# EAGLE design PIDDYBOT_V1 (EAGLE 6.5.0)
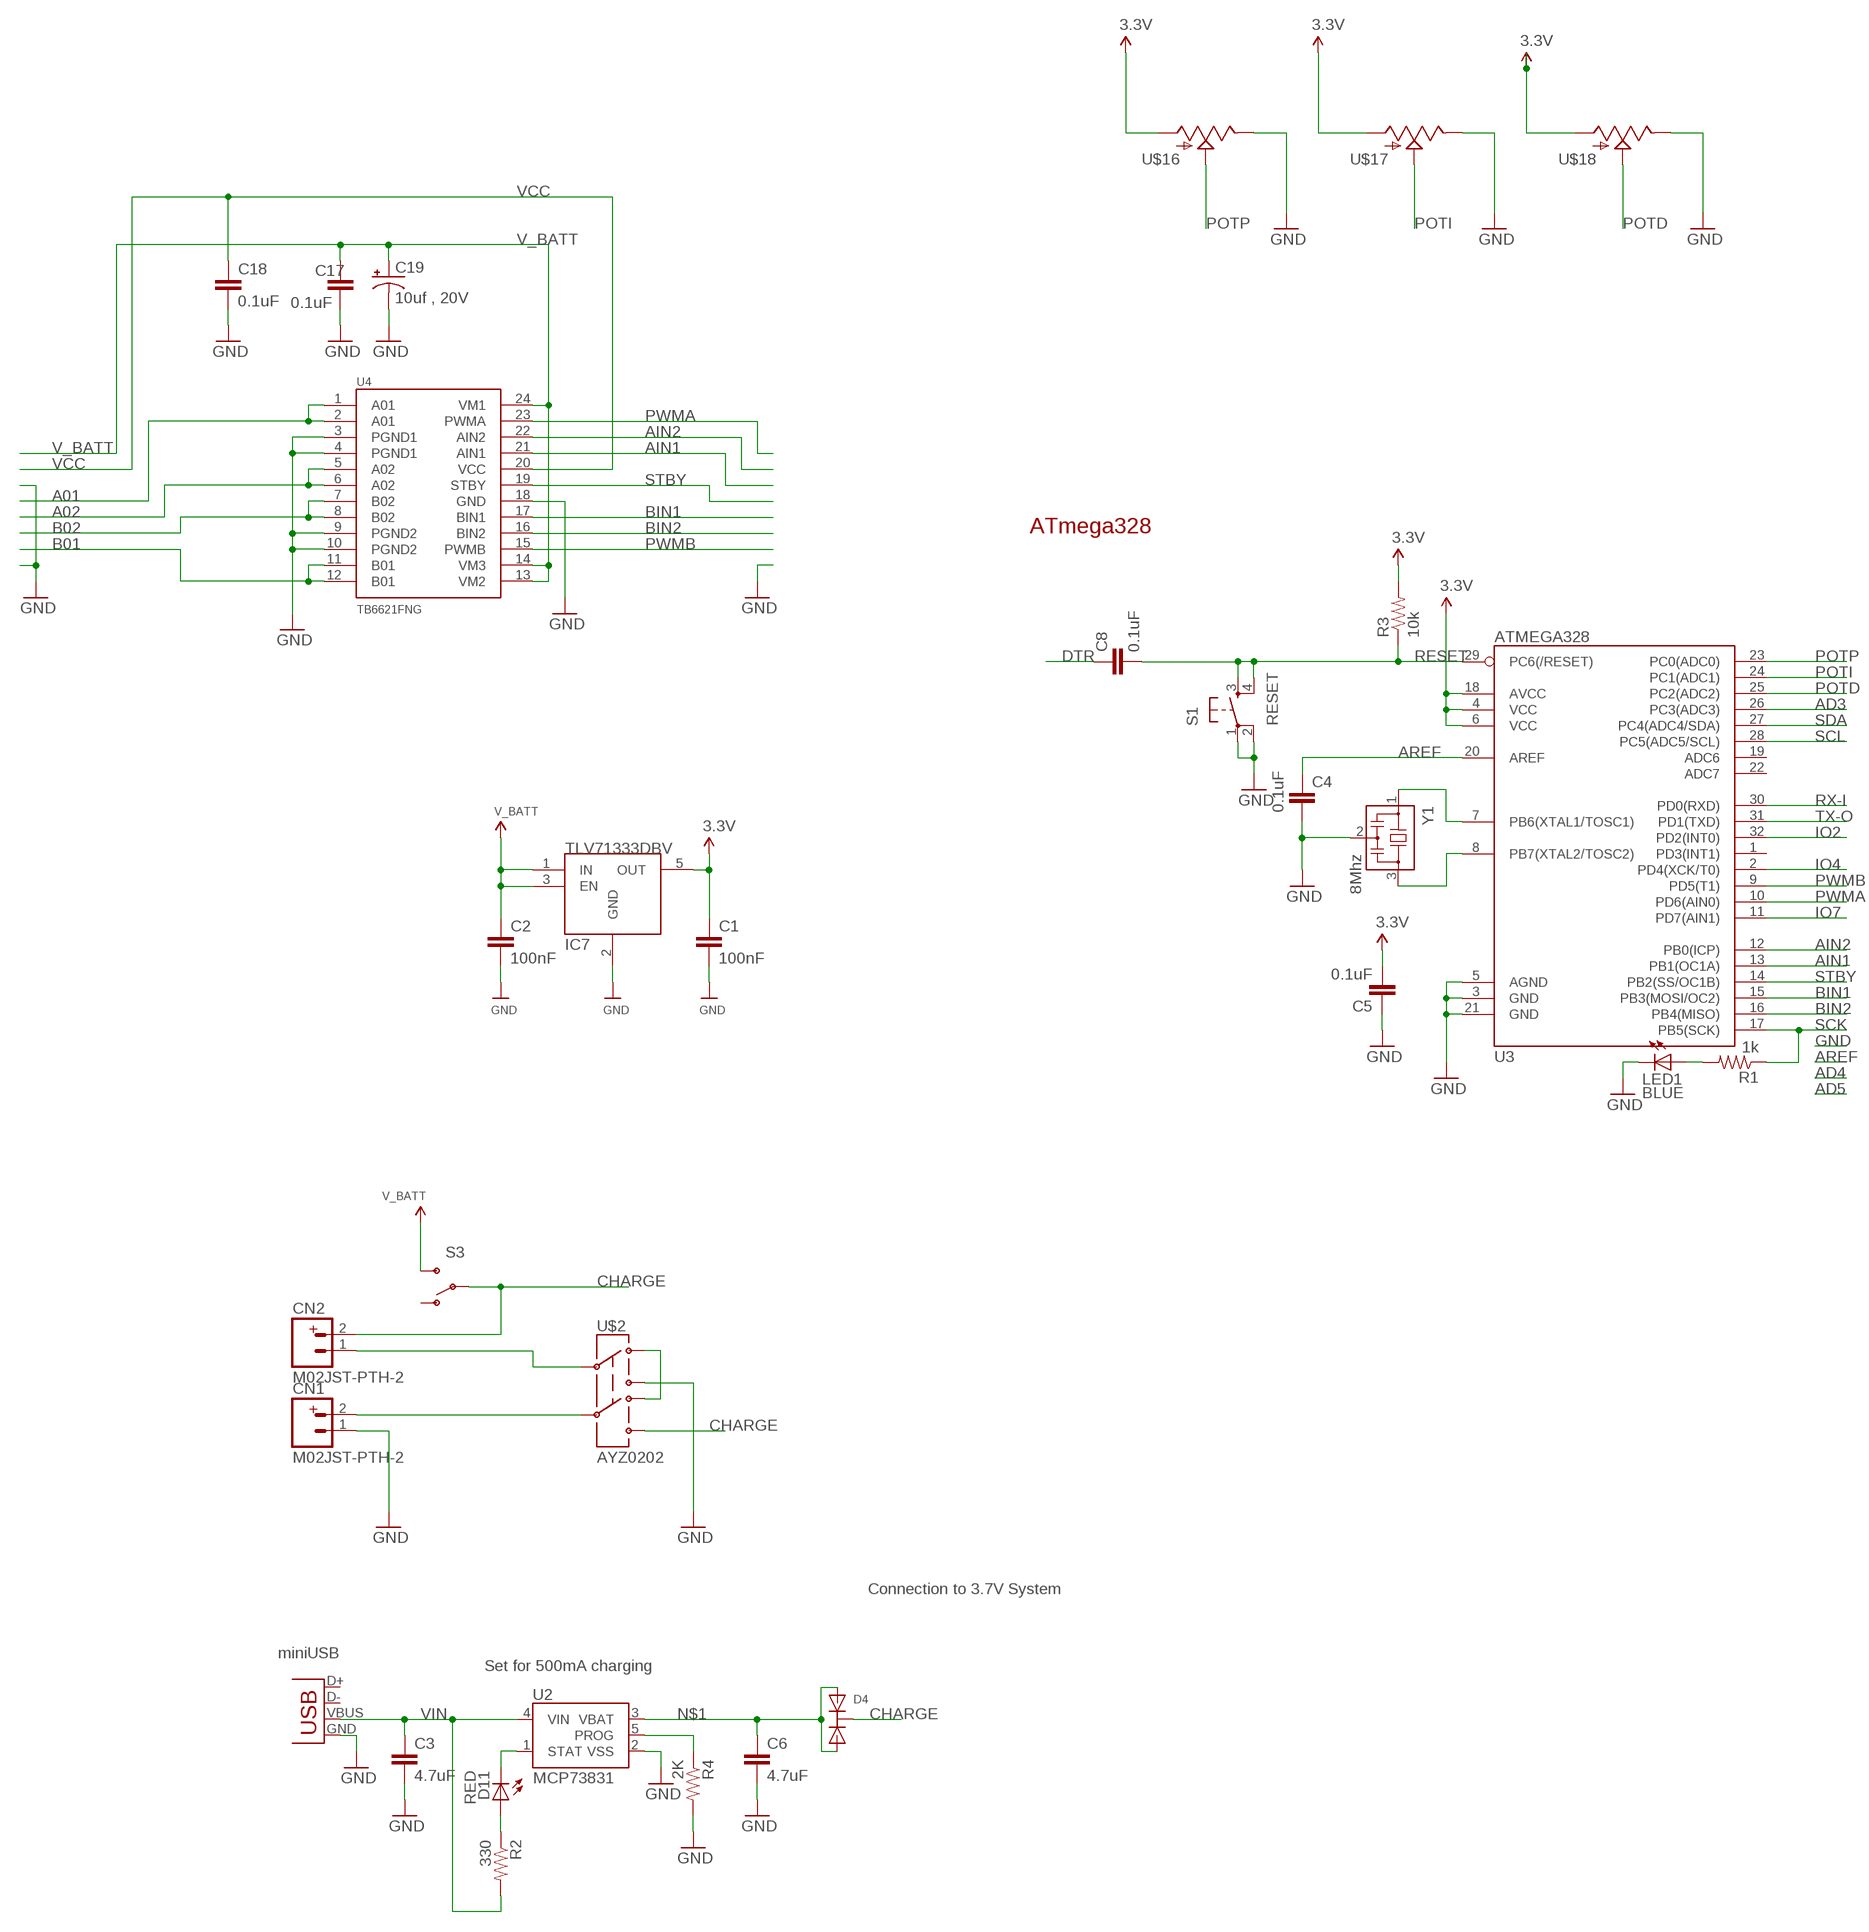
[diagram p0: schematic, sheet 1, part 1 of 2]
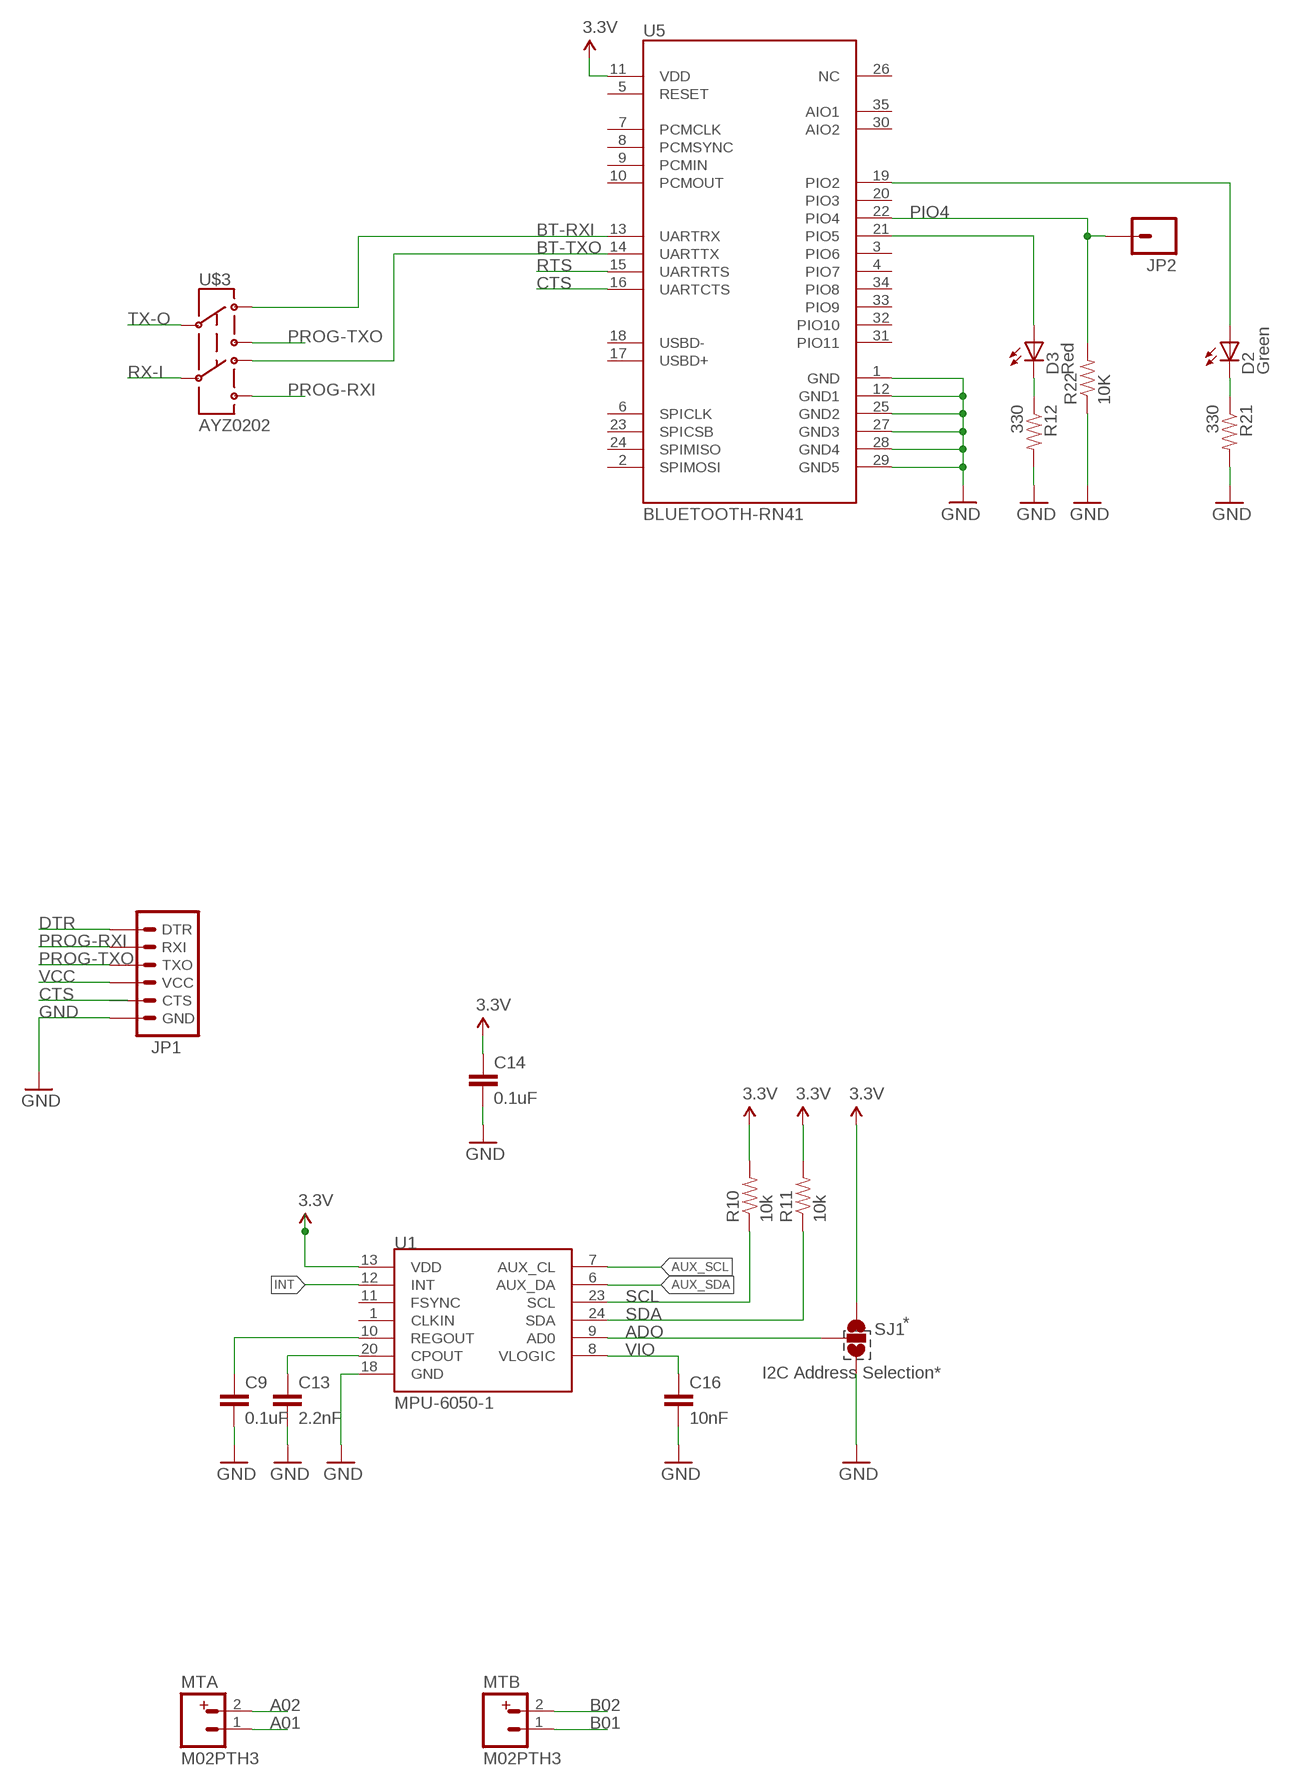
[diagram p1: schematic, sheet 1, part 2 of 2]

## Parts
C1  100nF  C-EUC0603K  [C0603K]
C2  100nF  C-EUC0603K  [C0603K]
C3  4.7uF  CAP0402-CAP  [0402-CAP]
C4  0.1uF  CAP0402-CAP  [0402-CAP]
C5  0.1uF  CAP0402-CAP  [0402-CAP]
C6  4.7uF  CAP0402-CAP  [0402-CAP]
C8  0.1uF  CAP0402-CAP  [0402-CAP]
C9  0.1uF  CAP0603-CAP  [0603-CAP]
C13  2.2nF  CAP0603-CAP  [0603-CAP]
C14  0.1uF  CAP0603-CAP  [0603-CAP]
C16  10nF  CAP0603-CAP  [0603-CAP]
C17  0.1uF  CAP0402-CAP  [0402-CAP]
C18  0.1uF  CAP0402-CAP  [0402-CAP]
C19  10uf , 20V  CAP_POL3528  [EIA3528]
CN1  M02JST-PTH-2  [JST-2-PTH]
CN2  M02JST-PTH-2  [JST-2-PTH]
D2  Green  LED0603  [LED-0603]
D3  Red  LED0603  [LED-0603]
D4  BAT54C  [SOT23-R]
D11  RED  LED0603  [LED-0603]
IC7  TLV71333DBV  [SOT-23-5]
JP1  ARDUINO_SERIAL_PROGRAMSMD  [1X06-SMD]
JP2  M01SMDNS  [1X01NS]
LED1  BLUE  LED0603  [LED-0603]
MTA  M02PTH3  [1X02_LONGPADS]
MTB  M02PTH3  [1X02_LONGPADS]
R1  1k  RESISTOR0402-RES  [0402-RES]
R2  330  RESISTOR0402-RES  [0402-RES]
R3  10k  RESISTOR0402-RES  [0402-RES]
R4  2K  RESISTOR0402-RES  [0402-RES]
R10  10k  RESISTOR0603-RES  [0603-RES]
R11  10k  RESISTOR0603-RES  [0603-RES]
R12  330  RESISTOR0402-RES  [0402-RES]
R21  330  RESISTOR0402-RES  [0402-RES]
R22  10K  RESISTOR0402-RES  [0402-RES]
S1  RESET  TAC_SWITCHSMD  [TACTILE_SWITCH_SMD]
S3  SWITCH-SPDTPTH  [SWITCH-SPDT]
SJ1  SOLDERJUMPER_2WAYPASTE2&3  [SJ_3_PASTE2&3]
U1  MPU-6050-1  [QFN-24-4MM2]
U2  MCP73831  [SOT23-5]
U3  ATMEGA328  ATMEGA168  [TQFP32-08]
U4  TB6621FNG  [SSOP24]
U5  BLUETOOTH-RN41  BLUETOOTH-RN41"  [RN41]
U$2  AYZ0202  [AYZ0202]
U$3  AYZ0202  [AYZ0202]
U$16  POT  [ALPS_POT]
U$17  POT  [ALPS_POT]
U$18  POT  [ALPS_POT]
X1  Micro USB  USBSMD  [USB-MINIB]
Y1  8Mhz  CSTCR6M00G53Z  [CSTCR6M]

## Nets
A01: MTA.1 U4.1(A01) U4.2(A01)
A02: MTA.2 U4.5(A02) U4.6(A02)
AD3: U3.26(PC3(ADC3))
ADO: SJ1.2 U1.9(AD0)
AIN1: U3.13(PB1(OC1A)) U4.21(AIN1)
AIN2: U3.12(PB0(ICP)) U4.22(AIN2)
AREF: C4.1 U3.20(AREF)
AUX_SCL: U1.7(AUX_CL)
AUX_SDA: U1.6(AUX_DA)
B01: MTB.1 U4.11(B01) U4.12(B01)
B02: MTB.2 U4.7(B02) U4.8(B02)
BIN1: U3.15(PB3(MOSI/OC2)) U4.17(BIN1)
BIN2: U3.16(PB4(MISO)) U4.16(BIN2)
BT-RXI: U5.13(UARTRX) U$3.3
BT-TXO: U5.14(UARTTX) U$3.6
CHARGE: CN2.2 D4.3(C) S3.2(P) U$2.4
CTS: U5.16(UARTCTS)
D1: D3.C R12.1
D2: D2.C R21.1
DTR: C8.1 JP1.1(DTR)
GND [vcc]: C1.2 C2.2 C3.2 C4.2 C5.1 C6.2 C9.2 C13.2 C14.2 C16.2 C17.2 C18.2 C19.C(-) CN1.1 IC7.2(GND) JP1.6(GND) LED1.C R4.2 R12.2 R21.2 R22.1 S1.1 S1.2 SJ1.3 U1.18(GND) U2.2(VSS) U3.3(GND) U3.5(AGND) U3.21(GND) U4.3(PGND1) U4.4(PGND1) U4.9(PGND2) U4.10(PGND2) U4.18(GND) U5.1(GND) U5.12(GND1) U5.25(GND2) U5.27(GND3) U5.28(GND4) U5.29(GND5) U$2.1 U$16.P$1(E) U$17.P$1(E) U$18.P$1(E) X1.GND Y1.2
INT: U1.12(INT)
IO2: U3.32(PD2(INT0))
IO4: U3.2(PD4(XCK/T0))
IO7: U3.11(PD7(AIN1))
N$1: C6.1 D4.1(A1) D4.2(A2) U2.3(VBAT)
N$2: CN2.1 U$2.2
N$3: LED1.A R1.2
N$4: U3.7(PB6(XTAL1/TOSC1)) Y1.1
N$5: U3.8(PB7(XTAL2/TOSC2)) Y1.3
N$6: C13.1 U1.20(CPOUT)
N$7: C9.1 U1.10(REGOUT)
N$8: CN1.2 U$2.5
N$9: D3.A U5.21(PIO5)
N$10: U$2.3 U$2.6
N$11: D2.A U5.19(PIO2)
N$13: D11.A R2.1
PIO4: JP2.1 R22.2 U5.22(PIO4)
POTD: U3.25(PC2(ADC2)) U$18.P$2(S)
POTI: U3.24(PC1(ADC1)) U$17.P$2(S)
POTP: U3.23(PC0(ADC0)) U$16.P$2(S)
PROG: R4.1 U2.5(PROG)
PROG-RXI: JP1.2(RXI) U$3.4
PROG-TXO: JP1.3(TXO) U$3.1
PWMA: U3.10(PD6(AIN0)) U4.23(PWMA)
PWMB: U3.9(PD5(T1)) U4.15(PWMB)
RESET: C8.2 R3.1 S1.3 S1.4 U3.29(PC6(/RESET))
RTS: U5.15(UARTRTS)
RX-I: U3.30(PD0(RXD)) U$3.5
SCK: R1.1 U3.17(PB5(SCK))
SCL: R10.1 U1.23(SCL) U3.28(PC5(ADC5/SCL))
SDA: R11.1 U1.24(SDA) U3.27(PC4(ADC4/SDA))
STAT: D11.C U2.1(STAT)
STBY: U3.14(PB2(SS/OC1B)) U4.19(STBY)
TX-O: U3.31(PD1(TXD)) U$3.2
V_BATT: C2.1 C17.1 C19.A(+) IC7.1(IN) IC7.3(EN) S3.3(S) U4.13(VM2) U4.14(VM3) U4.24(VM1)
VCC: C1.1 C5.2 C14.1 C18.1 IC7.5(OUT) JP1.4(VCC) R3.2 R10.2 R11.2 SJ1.1 U1.13(VDD) U3.4(VCC) U3.6(VCC) U3.18(AVCC) U4.20(VCC) U5.11(VDD) U$16.P$3(A) U$17.P$3(A) U$18.P$3(A) ; supply symbol labelled 3.3V
VIN: C3.1 R2.2 U2.4(VIN) X1.VBUS
VIO: C16.1 U1.8(VLOGIC)
Unconnected: JP1.5(CTS) S3.1(O) U1.1(CLKIN) U1.11(FSYNC) U3.1(PD3(INT1)) U3.19(ADC6) U3.22(ADC7) U5.2(SPIMOSI) U5.3(PIO6) U5.4(PIO7) U5.5(RESET) U5.6(SPICLK) U5.7(PCMCLK) U5.8(PCMSYNC) U5.9(PCMIN) U5.10(PCMOUT) U5.17(USBD+) U5.18(USBD-) U5.20(PIO3) U5.23(SPICSB) U5.24(SPIMISO) U5.26(NC) U5.30(AIO2) U5.31(PIO11) U5.32(PIO10) U5.33(PIO9) U5.34(PIO8) U5.35(AIO1) X1.D+ X1.D-

## Notes on the sheet
- ATmega328
- *
- I2C Address Selection*
- Connection to 3.7V System
- miniUSB
- Set for 500mA charging

## Library data of the parts
C1 C2 = rcl:C-EU: CAPACITOR, European symbol
C3-C6 C8 C9 C13 C14 C16-C18 = SparkFun:CAP: Capacitor Standard 0603 ceramic capacitor, and 0.1" leaded capacitor.
C19 = SparkFun:CAP_POL: Capacitor Polarized These are standard SMD and PTH capacitors. Normally 10uF, 47uF, and 100uF in electrolytic and tantalum varieties. Always verify the external diameter of the through hole cap, it varies with capacity, voltage, and manufacturer. The EIA devices should be standard.
CN1 CN2 MTA MTB = SparkFun-Connectors:M02: Standard 2-pin 0.1" header. Use with - straight break away headers ( PRT-00116) - right angle break away headers (PRT-00553) - swiss pins (PRT-00743) - machine pins (PRT-00117) - female headers (PRT-00115) Molex polarized connector foot print use with: PRT-08233 with associated crimp pins and housings. 2.54_SCREWTERM for use with PRT-10571. 3.5mm Screw Terminal footprints for PRT-08084 5mm Screw Terminal footprints for use with PRT-08433
D2 D3 D11 LED1 = SparkFun:LED: LEDs Standard schematic elements and footprints for 5mm, 3mm, 1206, and 0603 sized LEDs. 5mm - Spark Fun Electronics SKU : COM-00529 (and others)
D4 = microbuilder:BAT54C: BAT54C Schottky Diodes (Common Cathode) Vf: 800mV, 30V 200mA Digikey: BAT54CFSCT-ND For 300mA see BAT54CFILM: Vf: 900mV, 40V 300mA Digkey: 497-3786-2-ND
IC7 = anoven:TLV713: Capacitor-Free, 150-mA, Low-Dropout Regulator with Foldback Current Limit for Portable Devices
JP1 = SparkFun-Connectors:ARDUINO_SERIAL_PROGRAM: FTDI connector footprints
JP2 = SparkFun:M01: Header 1 Standard 1-pin 0.1" header. Use with straight break away headers (SKU : PRT-00116), right angle break away headers (PRT-00553), swiss pins (PRT-00743), machine pins (PRT-00117), and female headers (PRT-00115).
R1-R4 R10-R12 R21 R22 = SparkFun:RESISTOR: Resistor Basic schematic elements and footprints for 0603, 1206, and PTH resistors.
S1 = SparkFun:TAC_SWITCH: Momentary Switch Button commonly used for reset or general input. Spark Fun Electronics SKU : COM-00097
S3 = SparkFun-Electromechanical:SWITCH-SPDT: SPDT Switch Simple slide switch, Spark Fun Electronics SKU : COM-00102 DPDT SMT slide switch, AYZ0202, SWCH-08179
SJ1 = SparkFun:SOLDERJUMPER_2WAY: Solder Jumper 2 way solder jumper
U1 = Testing:MPU-6050
U2 = SparkFun:MCP73831: Microchip's MCP73831 Miniature single cell, fully integrated Li-Ion, Li-polymer charge management controller http://ww1.microchip.com/downloads/en/DeviceDoc/21984a.pdf
U3 = SparkFun:ATMEGA168
U4 = SparkFun:TB6621FNG: Toshiba 1A motor driver
U5 = ScratchPad:BLUETOOTH-RN41
U$2 U$3 = SparkFun-Electromechanical:AYZ0202: SPDT Slide Switch Simple SMD single-pull double-throw slide switch. Good for less than 350mA power switch, switching UARTs between devices, etc. Spark Fun Electronics SKU : COM-00597
U$16-U$18 = SparkFun-Electromechanical:POT
X1 = SparkFun:USB: USB Connectors USB-B-PTH is fully proven SKU : PRT-00139 USB-miniB is fully proven SKU : PRT-00587 USB-A-PCB is untested. USB-A-H is throughly reviewed, but untested. Spark Fun Electronics SKU : PRT-00437 USB-B-SMT is throughly reviewed, but untested. Needs silkscreen touching up. USB-A-S has not been used/tested USB-MB-H has not been used/tested
Y1 = murata-filter:CSTCR: Resonator Source: murata.co.jp; MPN: CSTCR6M00G53-R0; OC_FARNELL: 1170434; OC_NEWARK: 25M8759

## Net classes
1 vcc: width 0.254 mm

## Board
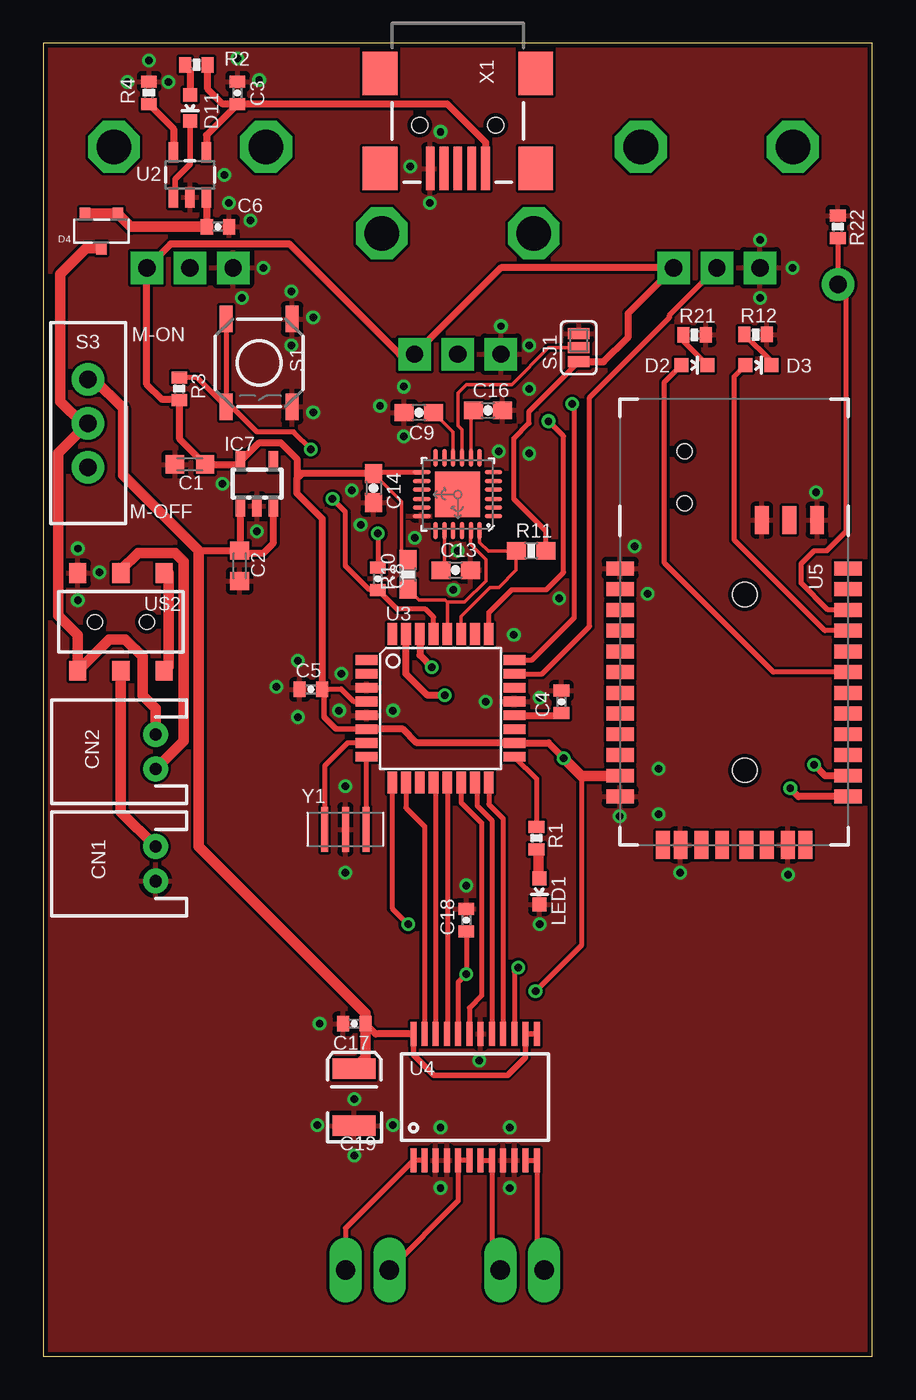
[diagram p2: board, top side]
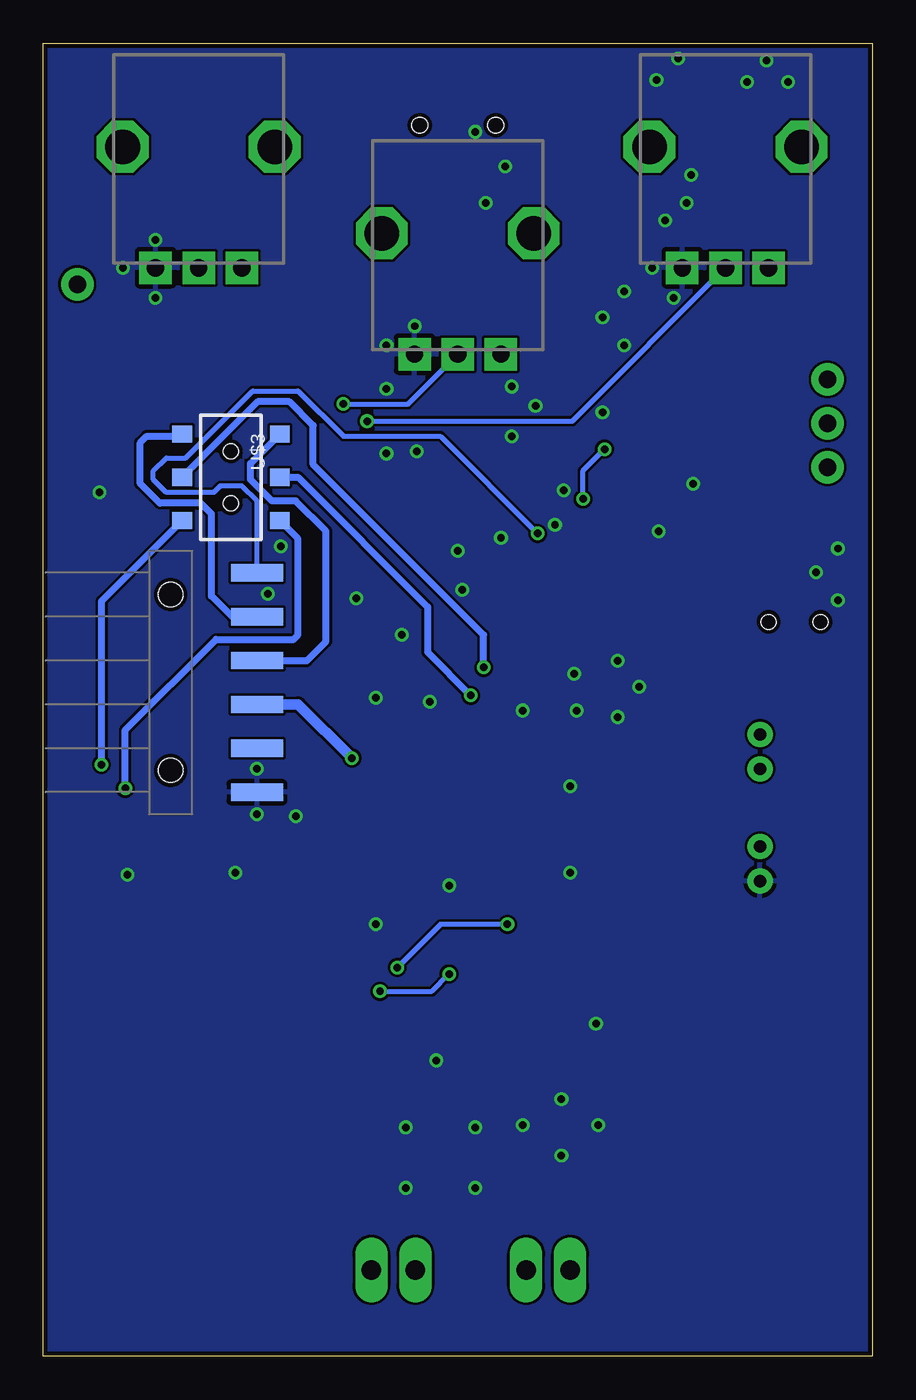
[diagram p3: board, bottom side, seen from below]

Size 48 x 76 mm. Coordinates in mm from the lower left corner, seen from the top.
Outline: 0,0 48,0 48,76 0,76 0,0
Copper layers (1*16): Top 0.0356mm / dielectric 1.5011mm / Bottom 0.0356mm
Design rules "LaenPCBOrder *": minimum track width 6mil, minimum drill 13mil, track to track 6mil, track to pad 6mil, pad to pad 6mil, via to via 6mil, smd to smd 6mil, copper to edge 10mil, drill to drill 6mil, minimum pad ring 7mil, minimum via ring 7mil, stop-mask expansion 3mil, vias tented up to drill 0mil, thermal gap 10mil

### Footprints (pad centres in the part's own frame; a part is rotated, then mirrored left to right if it is on the bottom)
C0603K = smd 1.05 x 1.08: 1 -0.875,0; 2 0.875,0
0402-CAP = smd 0.7 x 0.9: 1 -0.65,0; 2 0.65,0
0603-CAP = smd 1.1 x 1: 1 -0.85,0; 2 0.85,0
EIA3528 = smd 1.2 x 2.5: A 1.65,0; C -1.65,0
JST-2-PTH = drill 0.7 pad 1.448: 1 -1,0; 2 1,0
LED-0603 = smd 0.8 x 0.8: A 0,-0.75; C 0,0.75
SOT23-R = smd 0.6 x 0.7: 1 -0.95,-1; 2 0.95,-1; 3 0,1
SOT-23-5 = smd 0.55 x 1.2: 1 -0.95,-1.3; 2 0,-1.3; 3 0.95,-1.3; 4 0.95,1.3; 5 -0.95,1.3
1X06-SMD = smd 1 x 3: 1 -6.35,5; 2 -3.81,5; 3 -1.27,5; 4 1.27,5; 5 3.81,5; 6 6.35,5 | hole 1.4: -5.08,0; 5.08,0
1X01NS = drill 1.016 pad 1.88: 1 0,0
1X02_LONGPADS = drill 1.118 pad 1.88 long: 1 0,0; 2 2.54,0
0402-RES = smd 0.7 x 0.9: 1 -0.65,0; 2 0.65,0
0603-RES = smd 1.1 x 1: 1 -0.85,0; 2 0.85,0
TACTILE_SWITCH_SMD = smd 1.524 x 0.762: 1 -2.54,1.905; 2 2.54,1.905; 3 -2.54,-1.905; 4 2.54,-1.905
SWITCH-SPDT = drill 1.016 pad 1.88: 1 0,2.54; 2 0,0; 3 0,-2.54
SJ_3_PASTE2&3 = smd 0.635 x 1.27: 1 -0.813,0; 2 0,0; 3 0.813,0
QFN-24-4MM2 = smd 1.016 x 0.254: 1 -2.066,1.257; 2 -2.066,0.75; 3 -2.066,0.247; 4 -2.066,-0.287; 5 -2.066,-0.792; 6 -2.066,-1.297; 13 2.086,-1.297; 14 2.086,-0.792; 15 2.086,-0.287; 16 2.086,0.247; 17 2.086,0.75; 18 2.086,1.257 | smd 0.254 x 1.016: 7 -1.267,-2.122; 8 -0.762,-2.122; 9 -0.258,-2.122; 10 0.278,-2.122; 11 0.78,-2.122; 12 1.287,-2.122; 19 1.287,2.082; 20 0.78,2.082; 21 0.278,2.082; 22 -0.258,2.082; 23 -0.762,2.082; 24 -1.267,2.082 | smd 2.616 x 2.616: P$1 0.02,-0.01
SOT23-5 = smd 0.55 x 1.2: 1 -0.95,-1.3; 2 0,-1.3; 3 0.95,-1.3; 4 0.95,1.3; 5 -0.95,1.3
TQFP32-08 = smd 1.27 x 0.559: 1 -4.293,2.8; 2 -4.293,2; 3 -4.293,1.2; 4 -4.293,0.4; 5 -4.293,-0.4; 6 -4.293,-1.2; 7 -4.293,-2; 8 -4.293,-2.8; 17 4.293,-2.8; 18 4.293,-2; 19 4.293,-1.2; 20 4.293,-0.4; 21 4.293,0.4; 22 4.293,1.2; 23 4.293,2; 24 4.293,2.8 | smd 0.559 x 1.27: 9 -2.8,-4.293; 10 -2,-4.293; 11 -1.2,-4.293; 12 -0.4,-4.293; 13 0.4,-4.293; 14 1.2,-4.293; 15 2,-4.293; 16 2.8,-4.293; 25 2.8,4.293; 26 2,4.293; 27 1.2,4.293; 28 0.4,4.293; 29 -0.4,4.293; 30 -1.2,4.293; 31 -2,4.293; 32 -2.8,4.293
SSOP24 = smd 0.348 x 1.397: 1 -3.575,-3.656; 2 -2.925,-3.656; 3 -2.275,-3.656; 4 -1.625,-3.656; 5 -0.975,-3.656; 6 -0.325,-3.656; 7 0.325,-3.656; 8 0.975,-3.656; 9 1.625,-3.656; 10 2.275,-3.656; 11 2.925,-3.656; 12 3.575,-3.656; 13 3.575,3.656; 14 2.925,3.656; 15 2.275,3.656; 16 1.625,3.656; 17 0.975,3.656; 18 0.325,3.656; 19 -0.325,3.656; 20 -0.975,3.656; 21 -1.625,3.656; 22 -2.275,3.656; 23 -2.925,3.656; 24 -3.575,3.656
RN41 = smd 0.8 x 1.6: 1 -6.6,-6.6; 2 -5.4,-6.6; 3 -4.2,-6.6; 4 -3,-6.6; 5 -1.8,-6.6; 6 -0.6,-6.6; 7 0.6,-6.6; 8 1.8,-6.6; 9 3,-6.6; 10 4.2,-6.6; 11 5.4,-6.6; 12 6.6,-6.6; 13 6.6,6.6; 14 5.4,6.6; 15 4.2,6.6; 16 3,6.6; 17 1.8,6.6; 18 0.6,6.6; 19 -0.6,6.6; 20 -1.8,6.6; 21 -3,6.6; 22 -4.2,6.6; 23 -5.4,6.6; 24 -6.6,6.6 | smd 1.6 x 0.8: 25 -9.4,4.8; 26 -9.4,3.2; 27 -9.4,1.6; 28 9.4,3.1; 29 9.4,-3.1; 30 9.4,-4.122; 31 9.4,-1.9; 32 9.4,-0.7; 33 9.4,0.7; 34 9.4,1.9; 35 9.4,4.122
AYZ0202 = smd 1 x 1.15: 1 -2.5,2.825; 2 0,2.825; 3 2.5,2.825; 4 -2.5,-2.825; 5 0,-2.825; 6 2.5,-2.825 | hole 0.85: 1.5,0; -1.5,0
ALPS_POT = drill 1 pad 1.88 square: P$1 7,-2.5; P$2 7,0; P$3 7,2.5 | drill 2 octagon: P$4 0,-4.4; P$5 0,4.4
USB-MINIB = smd 2.5 x 0.5: D+ 2.5,0; D- 2.5,0.8; GND 2.5,-1.6; ID 2.5,-0.8; VBUS 2.5,1.6 | smd 2.5 x 2: MTN1 -3,4.5; MTN2 2.5,4.5; MTN3 -3,-4.5; MTN4 2.5,-4.5 | hole 0.9: 0,2.2; 0,-2.2
CSTCR6M = smd 0.4 x 2.6: 1 -1.2,0; 2 0,0; 3 1.2,0

### Placement (x,y rotation side)
C1  8.5,51.62 180 top
C2  11.38,45.75 270 top
C3  11.25,73.12 90 top
C4  30,37.88 90 top
C5  15.5,38.59 0 top
C6  10.12,65.38 0 top
C8  19.38,45 270 top
C9  21.75,54.62 180 top
C13  23.88,45.5 0 top
C14  19.12,50.25 270 top
C16  25.75,54.75 0 top
C17  18,19.25 180 top
C18  24.5,25.25 90 top
C19  18,15 90 top
CN1  6.5,28.5 90 top
CN2  6.5,35 90 top
D2  37.7,57.37 270 top
D3  41.4,57.36 270 top
D4  3.38,65.12 180 top
D11  8.5,72.25 180 top
IC7  12.38,50.5 0 top
JP1  40.62,39 270 bottom
JP2  46.02,62.05 0 top
LED1  28.73,26.91 180 top
MTA  17.5,5 0 top
MTB  29,5 180 top
R1  28.55,29.99 270 top
R2  8.88,74.75 0 top
R3  7.88,56 270 top
R4  6.12,73.12 90 top
R10  21.12,45.25 90 top
R11  28.25,46.62 0 top
R12  41.25,59.13 0 top
R21  37.71,59.12 0 top
R22  46,65.38 270 top
S1  12.5,57.5 270 top
S3  2.6,54 180 top
SJ1  31,58.38 90 top
U1  24,49.88 180 top
U2  8.5,68.38 0 top
U3  23,37.5 0 top
U4  25,15 0 top
U5  40,39 270 top
U$2  4.5,42.5 0 top
U$3  37.12,50.88 270 bottom
U$16  39,70 270 bottom
U$17  24,65 270 bottom
U$18  8.5,70 270 bottom
X1  24,71.25 270 top
Y1  17.5,30.5 0 top

### Tracks (layer width: path | path; a pad name or v marks a point on that pad's centre or on a via)
A01
  Top 0.3: U4.2 U4.1 17.5,7.42 MTA.1
A02
  Top 0.3: U4.6 U4.5 24.02,8.98 MTA.2
ADO
  Top 0.2: U1.9 24.26,53.37 24.25,53.38 24.25,53.62 24,53.88 24,55.75 24.5,56.25 27.12,56.25 29.25,58.38 SJ1.2
AIN1
  Top 0.3: U3.13 23.4,18.68 U4.21
AIN2
  Top 0.3: U3.12 22.73,33.08 U4.22
AREF
  Top 0.406: U3.20 29.88,37.1 C4.1
B01
  Top 0.3: U4.11 U4.12 28.57,5.42 MTB.1
B02
  Top 0.3: U4.7 U4.8 25.98,5.49 MTB.2
BIN1
  Top 0.3: U3.15 25.12,33.08 25.12,31.88 25.98,31.02 U4.17
BIN2
  Top 0.3: U3.16 25.8,31.95 26.62,31.12 U4.16
BT-RXI  (via drill 0.43)
  Top 0.406: U5.13 43.73,32.4 v43.25,32.88
  Bottom 0.406: v43.25,32.88 43.25,36.25 38,41.5 33.5,41.5 33.25,41.75 33.25,47.33 U$3.3
BT-TXO  (via drill 0.43)
  Top 0.406: U5.14 45.27,33.6 v44.62,34.25
  Bottom 0.406: v44.62,34.25 44.62,43.7 U$3.6
CHARGE
  Top 0.61: CN2.2 6.5,37.5 5.75,38.25 5.75,40.5 4.75,41.5 3.83,41.5 U$2.4 2,41.75 0.88,42.88 0.88,52.27 S3.2 2.25,54 1,55.25 1,62.62 2.5,64.12 D4.3
D1
  Top 0.3: D3.C 42.15,57.59 R12.1
D2
  Top 0.3: D2.C 37.06,58.76 R21.1
DTR  (via drill 0.43)
  Top 0.3: v19.38,47.62 C8.1
  Bottom 0.3: JP1.1 35.62,49.5 36.5,50.38 37.75,50.38 38.12,50 40.88,50 41.62,50.75 41.62,51.25 40.88,52 39.75,52 35.88,55.88 33.25,55.88 30.62,53.25 25,53.25 v19.38,47.62
GND  (via drill 0.43)
  other vias: 2,46.75 2,43.75 14.75,37 14.75,40.25 13.5,38.75 17.5,28 17.5,33 24.5,27.25 27,9.75 23,9.75 23,13.25 27,13.25 25.25,17.12 24,46.62 21.5,47.38 18.38,48.12 17.88,50.12 20.88,53.25 19.5,55 20.88,56.12 26.38,52.38 28.12,56 28.12,52.25 44.75,50 33.38,31.25 35.62,31.38 35.62,34 36.88,28 43.12,27.88 28.75,25 15.88,13.38 18,14.88 18,11.62 20.25,13.38 16,19.25 11.5,61.25 12.75,63 26.5,59.62 28.12,58.5 41.5,64.62 43.38,63 41.5,61.25 22.38,66.75 21.25,68.88 12,65.75 10.75,66.75 6.12,75 4.88,73.75 7.25,73.75 12.5,73.88 11.25,75.12 10.5,68.38 10.38,50.5 12.38,47.75 3.25,45.38 15.62,60.12 14.38,61.62 14.38,58.5 15.62,54.62 34.25,46.88 35,44.12 17.25,39.5 20.25,37.38 17.12,37.38 25.62,37.88 28.75,38.12 23,70.88 23.75,44.38 29.88,43.88 27.25,41.75
  pour Top: 0,0 48,0 48,76 0,76
  pour Bottom: 0,0 48,0 48,76 0,76
N$1
  Top 0.406: U2.3 9.47,67.05 C6.1
  Top 0.61: C6.1 5.08,65.38 D4.1 D4.2
N$2
  Top 0.61: U$2.2 4.5,45.5 5.5,46.5 7.62,46.5 8.12,46 8.12,35.62 CN2.1
N$3
  Top 0.3: R1.2 28.67,29.23
  Top 0.61: 28.67,29.23 28.67,27.71 LED1.A
N$4
  Top 0.3: U3.7 17.62,35.5 16.3,34.17 Y1.1
N$5
  Top 0.3: U3.8 Y1.3
N$6
  Top 0.2: U1.20 23.22,45.7 C13.1
N$7
  Top 0.2: C9.1 23.72,53.5 U1.10
N$8
  Top 0.61: CN1.2 4.5,31.5 U$2.5
N$9
  Top 0.3: U5.21 45.25,42 40,47.25 40,56.71 D3.A
N$10
  Top 0.61: U$2.3 7.25,45.33 7.25,39.92 U$2.6
N$11
  Top 0.3: U5.19 42.27,39.6 35.95,45.92 35.95,56.37 D2.A
N$13
  Top 0.406: R2.1 8.5,74.47 D11.A
PIO4
  Top 0.3: U5.22 45.42,43.2 43.88,44.75 43.88,45.88 44.62,46.62 45.38,46.62 46.5,47.75 46.5,61.58 JP2.1 46.02,64.7 R22.2
POTD  (via drill 0.43)
  Top 0.3: U3.25 25.8,43.05 27.12,44.38 29.12,44.38 30.12,45.38 30.12,53.25 v29.25,54.12
  Bottom 0.3: v29.25,54.12 17.38,54.12 U$18.P$2
POTI  (via drill 0.43)
  Top 0.3: U3.24 28.3,40.3 30.75,42.75 30.75,55 v30.62,55.12 30.62,55
  Bottom 0.3: v30.62,55.12 26.88,55.12 U$17.P$2
POTP
  Top 0.3: U3.23 28.88,39.5 31.62,42.25 31.62,55.5 36.25,60.12 36.25,60.25 U$16.P$2
PROG
  Top 0.406: R4.1 7.55,71.05 U2.5
PROG-RXI
  Bottom 0.406: JP1.2 37.06,42.81 38.25,44 38.25,48.75 38.88,49.38 41.25,49.38 42.38,50.5 42.38,52.88 42,53.25 40.08,53.25 U$3.4
PROG-TXO
  Bottom 0.406: JP1.3 34.48,40.27 34.46,40.25 32.75,40.25 31.62,41.38 31.62,47.75 33.38,49.5 34.75,49.5 36,50.75 36,51.67 U$3.1
PWMA
  Top 0.3: U3.10 21,31.75 22.07,30.68 U4.23
PWMB  (via drill 0.43)
  Top 0.3: U3.9 20.2,25.93 v21.12,25 | v27.5,22.5 27.27,22.27 U4.15
  Bottom 0.3: v21.12,25 25,25 v27.5,22.5
RESET  (via drill 0.43)
  Top 0.3: U3.29 22.6,42.77 22.12,43.25 20.48,43.25 C8.2 18.9,44.35 17.5,45.75 17.5,48.88 v16.75,49.62 | S1.4 10.91,54.96 12.38,53.5 14.5,53.5 v15.5,52.5 | S1.4 8.9,56.65 R3.1 | S1.3 S1.4
  Bottom 0.3: v16.75,49.62 16.75,51.25 v15.5,52.5
RX-I  (via drill 0.43)
  Top 0.406: U3.30 21.8,40.58 v22.5,39.88
  Bottom 0.406: v22.5,39.88 22.5,41.75 32.38,51.62 32.38,53.88 33.75,55.25 35.58,55.25 U$3.5
SCK
  Top 0.3: U3.17 28.55,33.44 R1.1
SCL
  Top 0.2: 23.4,43.65 U3.28 | 23.4,43.65 24.4,43.65 25.62,44.88 25.62,46.12 24.75,47 U1.23 | R10.1 21.75,43.77 23.27,43.77 23.4,43.65
SDA
  Top 0.2: U3.27 24.2,42.83 25.88,44.5 26.38,44.5 27.38,45.5 27.38,46.6 | U1.24 25.27,47.11 25.77,46.6 27.38,46.6 | 27.38,46.6 R11.1
STAT
  Top 0.305: U2.1 7.62,67.08 7.62,68.12 8.5,69 D11.C
STBY
  Top 0.3: U3.14 24.2,32.05 25.38,30.88 25.38,20.88 24.68,20.18 U4.19
TX-O  (via drill 0.43)
  Top 0.406: v23.25,38.25 22.25,38.25 21,39.5 U3.31
  Bottom 0.406: U$3.2 33.25,50.88 25.75,43.38 25.75,40.75 v23.25,38.25
V_BATT
  Top 0.305: U4.24 21.43,17.45 22.62,16.25 26.88,16.25 27.93,17.3 U4.14 U4.13
  Top 0.406: U4.24 19.24,18.66 C17.1 | 9,46.62 C2.1 | C2.1 11.43,46.67 IC7.1 | C2.1 11.5,46.5 12.75,46.5 13.32,47.08 IC7.3
  Top 0.61: S3.3 2.96,56.54 4.62,54.88 4.62,51 9,46.62 9,29.5 18.65,19.85 C17.1 18.65,17.3 C19.A
VCC  (via drill 0.43)
  Top 0.2: C14.1 20.75,49.48 20.75,46.48 R10.2
  Top 0.3: C14.1 19.2,51.17 U1.13 | 31.15,33.6 31.15,23.77 v28.5,21.12 | U4.20 24.02,21.65 v24.5,22.12 C18.1 | R11.2 29.1,47.77 27.25,49.62 27.25,53.12 28.12,54 28.12,54.69 SJ1.1 | C5.2 16.18,38.62 17.25,38.62 17.98,37.9 U3.4
  Top 0.305: U3.6 16.95,36.3 16.25,37 16.25,38.49 C5.2 | R3.2 7.85,55.38
  Top 0.406: v30.12,34.62 29.25,35.5 U3.18 21.62,35.5 20.82,36.3 U3.6 | R3.2 7.88,53.12 C1.1 11.25,51.62 IC7.5 12.5,52.88 13.75,52.88 14.69,51.94 14.69,50.81 | C5.2 16.15,48.48 14.69,49.94 14.69,50.81 | C14.1 14.97,51.1 14.69,50.81 | 7.85,55.38 6.88,55.38 6,56.25 U$18.P$3 7.38,64.38 14.25,64.38 20.62,58 U$17.P$3 26.5,63 U$16.P$3 33.88,60.38 33.88,59 32.44,57.56 SJ1.1
  Top 0.61: v30.12,34.62 31.15,33.6 U5.11
  Bottom 0.3: v28.5,21.12 25.5,21.12 v24.5,22.12
  Bottom 0.61: JP1.4 33.23,37.73 v30.12,34.62
VIN
  Top 0.3: 25.62,69.03 25.62,68.9 X1.VBUS
  Top 0.406: 25.62,69.03 25.62,70.25 23.4,72.47 C3.1 | C3.1 9.45,70.67 U2.4 | C3.1 10.4,72.47 9.53,73.35 R2.2
VIO
  Top 0.2: C16.1 24.76,54.61 U1.8

### Text on the board
tNames: M-ON | M-OFF